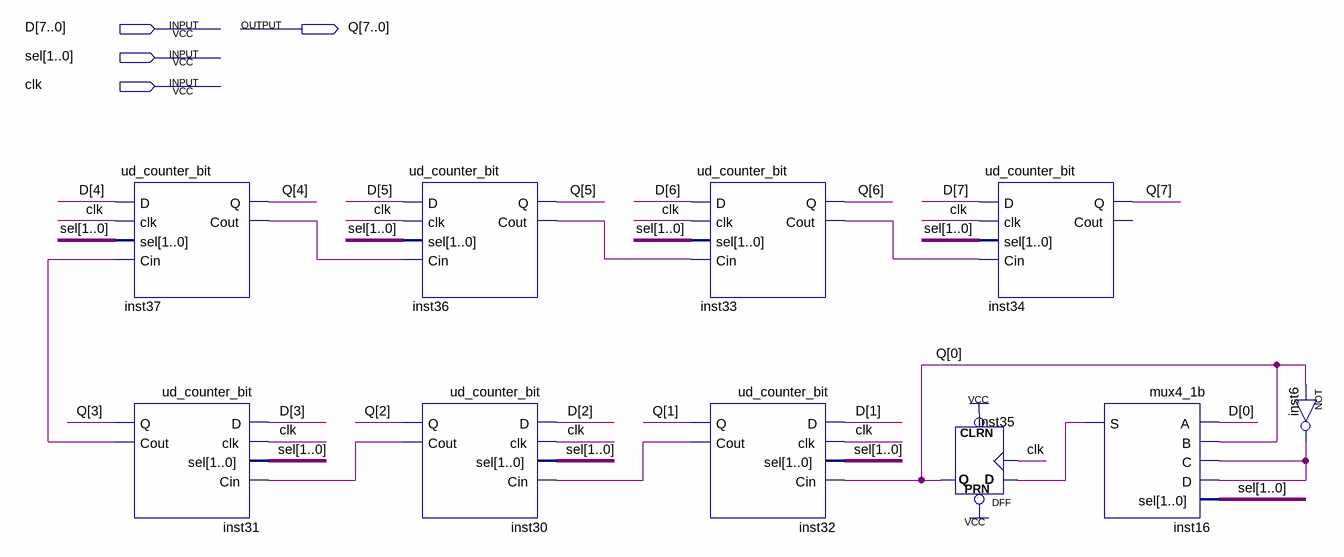
[diagram p0: schematic sheet]
// Quartus schematic counter.bdf as structural Verilog: 10 symbols, 4 pins
module counter (
  input  [7:0] D,
  input  [1:0] sel,
  input  clk,
  output [7:0] Q
);

  wire inst6_out, inst16_s, inst30_cout, inst31_cout, inst32_cout, inst33_cout, inst36_cout, inst37_cout;

  ud_counter_bit inst37 (.D(D[4]), .clk(clk), .sel(sel), .Cin(inst31_cout), .Q(Q[4]), .Cout(inst37_cout));
  ud_counter_bit inst31 (.D(D[3]), .clk(clk), .sel(sel), .Cin(inst30_cout), .Q(Q[3]), .Cout(inst31_cout));
  ud_counter_bit inst36 (.D(D[5]), .clk(clk), .sel(sel), .Cin(inst37_cout), .Q(Q[5]), .Cout(inst36_cout));
  ud_counter_bit inst30 (.D(D[2]), .clk(clk), .sel(sel), .Cin(inst32_cout), .Q(Q[2]), .Cout(inst30_cout));
  ud_counter_bit inst33 (.D(D[6]), .clk(clk), .sel(sel), .Cin(inst36_cout), .Q(Q[6]), .Cout(inst33_cout));
  ud_counter_bit inst32 (.D(D[1]), .clk(clk), .sel(sel), .Cin(Q[0]), .Q(Q[1]), .Cout(inst32_cout));
  DFF inst35 (.CLRN(1'b1), .CLK(clk), .D(inst16_s), .PRN(1'b1), .Q(Q[0]));
  ud_counter_bit inst34 (.D(D[7]), .clk(clk), .sel(sel), .Cin(inst33_cout), .Q(Q[7]));  // open: Cout
  mux4_1b inst16 (.A(D[0]), .B(Q[0]), .C(inst6_out), .D(inst6_out), .sel(sel), .S(inst16_s));
  not inst6 (inst6_out, Q[0]);
endmodule
